# Altium project AVR_ISP_mkii.PrjPcb
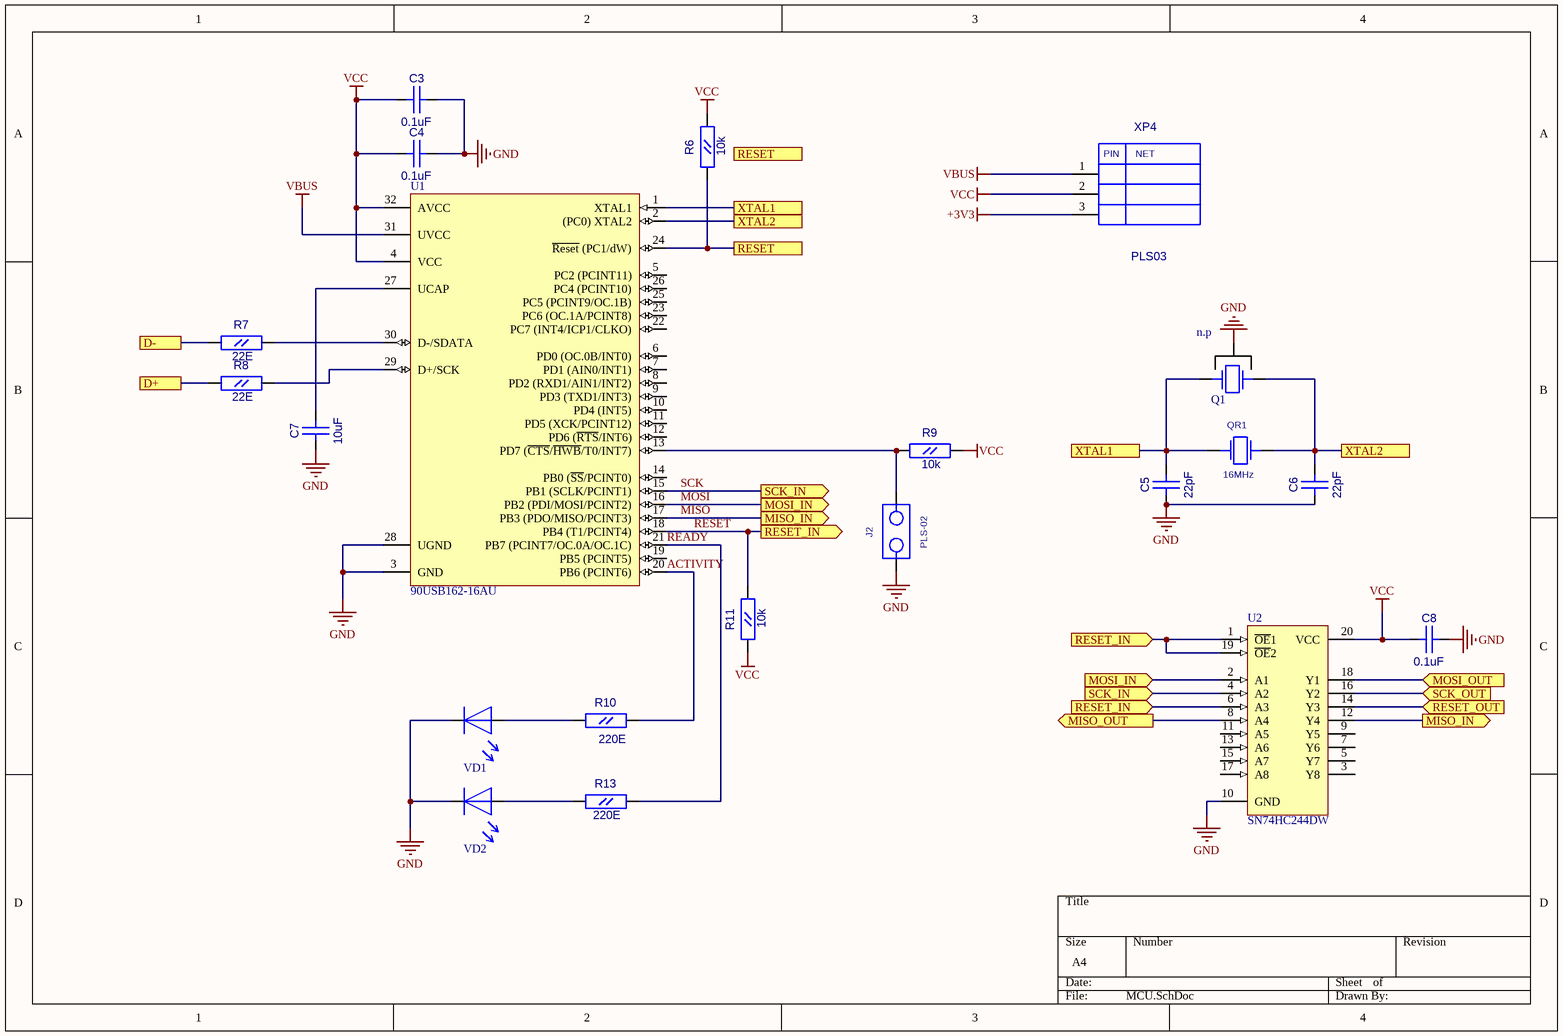
[diagram p0: MCU.SchDoc]
3 sheets, 38 parts. Net scope: flat (ports and power ports of the same name join across sheets).
Board file: AVR_ISP_mkii_clone.PcbDoc
Sheets:
  MCU.SchDoc
  Power.SchDoc
  Connections.SchDoc

## Sheet MCU.SchDoc
size A4

### Parts
C3  0.1uF  [CC0603]
C4  0.1uF  [CC0603]
C5  22pF  [CC0603]
C6  22pF  [CC0603]
C7  10uF  [CC0805]
C8  0.1uF  [CC0603]
J2  PLS-02  [PLS-02]
Q1  n.p  [AWSCR-16MHz]
QR1  16MHz  [AC5032_2]
R6  10k  [RC0603]
R7  22E  [RC0603]
R8  22E  [RC0603]
R9  10k  [RC0603]
R10  220E  [RC0603]
R11  10k  [RC0603]
R13  220E  [RC0603]
U1  90USB162-16AU  [32MA_N]
U2  SN74HC244DW  [DW020_N]
VD1  LED_0805  [LED0805]  (value not drawn)
VD2  LED_0805  [LED0805]  (value not drawn)
XP4  PLS03  [PLS-03]

### Ports
D+, D-, MISO_IN (out), MISO_OUT (out), MOSI_IN (in), MOSI_IN (out), MOSI_OUT (in), RESET, RESET_IN (in), RESET_IN (out), RESET_OUT (in), SCK_IN (in), SCK_IN (out), SCK_OUT (in), XTAL1, XTAL2

### Nets
+3V3: XP4.3
GND: C3.2(B) C4.2(B) C5.1(A) C6.1(A) C7.1(A) C8.2(B) J2.1 Q1.3 U1.3(GND) U1.28(UGND) U2.10(GND) VD1.2 VD2.2
VBUS: U1.31(UVCC) XP4.1
VCC: C3.1(A) C4.1(A) C8.1(A) R6.2(B) R9.2(B) R11.1(A) U1.4(VCC) U1.32(AVCC) U2.20(VCC) XP4.2
ACTIVITY: R10.2(B) U1.20(PB6_(PCINT6))
MISO: U1.17(PB3_(PDO/MISO/PCINT3)) U2.12(Y4) ; port MISO_IN
MOSI: U1.16(PB2_(PDI/MOSI/PCINT2)) U2.2(A1) ; port MOSI_IN
READY: R13.2(B) U1.21(PB7_(PCINT7/OC.0A/OC.1C))
RESET: R11.2(B) U1.18(PB4_(T1/PCINT4)) U2.1(~{OE}1) U2.6(A3) U2.19(~{OE}2) ; port RESET_IN
SCK: U1.15(PB1_(SCLK/PCINT1)) U2.4(A2) ; port SCK_IN
NetC5_2: C5.2(B) Q1.2 QR1.1 U1.1(XTAL1) ; port XTAL1
NetC6_2: C6.2(B) Q1.1 QR1.2 U1.2((PC0)_XTAL2) ; port XTAL2
NetC7_2: C7.2(B) U1.27(UCAP)
NetJ2_2: J2.2 R9.1(A) U1.13(PD7_(~{CTS}/~{HWB}/T0/INT7))
NetR1_1: U2.8(A4) ; port MISO_OUT
NetR2_2: U2.18(Y1) ; port MOSI_OUT
NetR3_1: U2.16(Y2) ; port SCK_OUT
NetR4_1: U2.14(Y3) ; port RESET_OUT
NetR6_1: R6.1(A) U1.24(~{Reset}_(PC1/dW)) ; port RESET
NetR7_1: R7.1(A) ; port D-
NetR7_2: R7.2(B) U1.30(D-/SDATA)
NetR8_1: R8.1(A) ; port D+
NetR8_2: R8.2(B) U1.29(D+/SCK)
NetR10_1: R10.1(A) VD1.1
NetR13_1: R13.1(A) VD2.1

Not connected (* = marked no-connect by the designer): U1 5(PC2_(PCINT11)) 6(PD0_(OC.0B/INT0)) 7(PD1_(AIN0/INT1)) 8(PD2_(RXD1/AIN1/INT2)) 9(PD3_(TXD1/INT3)) 10(PD4_(INT5)) 11(PD5_(XCK/PCINT12)) 12(PD6_(~{RTS}/INT6)) 14(PB0_(~{SS}/PCINT0)) 19(PB5_(PCINT5)) 22(PC7_(INT4/ICP1/CLKO)) 23(PC6_(OC.1A/PCINT8)) 25(PC5_(PCINT9/OC.1B)) 26(PC4_(PCINT10)); U2 3(Y8) 5(Y7) 7(Y6) 9(Y5) 11(A5) 13(A6) 15(A7) 17(A8)

### Notes on the sheet
- (in symbol PLS03) PIN; NET

### Library data of the parts
C3-C6 C8 = CC0603
  C3 C4 C8: Value: 0.1uF
  C5 C6: Value: 22pF
C7 = CC0805: Value: 10uF
Q1 = Q_AWSCR-16MHz: Value: AWSCR-16MHz; n.p: n.p
QR1 = AC5032_2: AC5032/2; Value: 16MHz
R6-R11 R13 = RC0603
  R6 R9 R11: Value: 10k
  R7 R8: Value: 22E
  R10 R13: Value: 220E
U1 = 90USB162-16AU: 8-bit AVR Microcontroller, 2.7-5.5V, 16KB Flash, 512 Bytes EEPROM, 512 Bytes SRAM, USB Controller, 32-pin TQFP, Industrial Grade (-40°C to 85°C); Published: 1-Apr-2010; DatasheetVersion: revE, Nov-2008; PackageVersion: revB, Jul-2007; PackageReference: 32MA; Publisher: Altium Limited; PackageDescription: 32-Lead Thin Profile Plastic Quad Flatpack (TQFP) - 7x7x1mm Body,  0.8 mm Pitch; ComponentLink1Description: Manufacturer Link; ComponentLink1URL: http://www.atmel.com/products/avr/default.asp?; ComponentLink2Description: AT90USB82/162 Datasheet; ComponentLink2URL: http://www.atmel.com/dyn/resources/prod_documents/doc7707.pdf; ComponentLink3Description: AT90USB82/162 Summary; ComponentLink3URL: http://www.atmel.com/dyn/resources/prod_documents/7707S.pdf; ComponentLink4Description: Atmel.com Home; ComponentLink4URL: http://www.atmel.com
U2 = SN74HC244DW: Octal Buffer and Line Driver with 3-State Outputs; Published: 8-Jun-2000; LatestRevisionDate: 13-Apr-2006; LatestRevisionNote: IPC-7351 Footprint Added.; DatasheetVersion: May-1997; PackageVersion: Mar-2000; PackageReference: DW020; Publisher: Altium Limited; PackageDescription: 20-Pin Plastic Small Outline Integrated Circuit 1.27 mm Pitch; Code_JEDEC: MS-013; Code_IPC: SOIC127P1030-20; ComponentLink1Description: Manufacturer Link; ComponentLink1URL: http://www.ti.com/; ComponentLink2Description: Datasheet; ComponentLink2URL: http://www-s.ti.com/sc/ds/sn74hc244.pdf
J2 = PLS-02: Value: *
VD1 VD2 = LED_0805: Value: LED_0805
XP4 = PLS03: Value: *

## Sheet Power.SchDoc
size A4
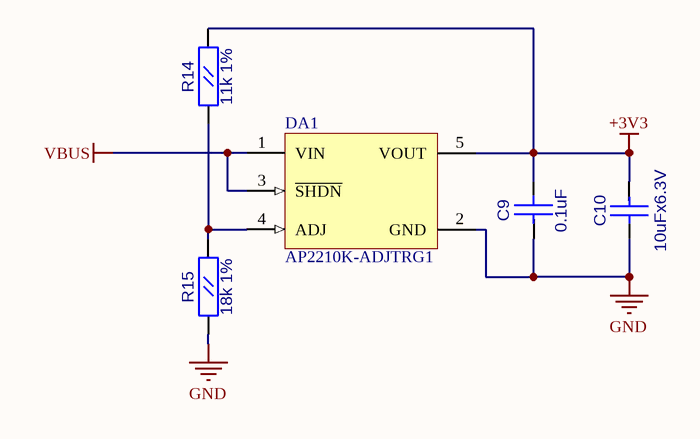
[diagram p1: Power.SchDoc]

### Parts
C9  0.1uF  [CC0603]
C10  10uFx6.3V  [CC0805]
DA1  AP2210K-ADJTRG1  [SOT23-5]
R14  11k 1%  [RC0603]
R15  18k 1%  [RC0603]

### Nets
+3V3: C9.1(A) C10.2(B) DA1.5(VOUT) R14.2(B)
GND: C9.2(B) C10.1(A) DA1.2(GND) R15.1(A)
VBUS: DA1.1(VIN) DA1.3(~{SHDN})
NetDA1_4: DA1.4(ADJ) R14.1(A) R15.2(B)

### Library data of the parts
C9 = CC0603: Value: 0.1uF
C10 = CC0805: Value: 10uFx6.3V
DA1 = MCP1824T-ADJE/OT: 300 mA, Low Voltage, Low Quiescent Current LDO Regulator, 5-Pin SOT-223, Extended Temperature, Tape and Reel; Published: 29-Jan-2009; DatasheetVersion: revA, Aug-2007; PackageVersion: revAW, Oct-2008; PackageReference: SOT-223-DC5; Publisher: Altium Limited; PackageDescription: 5-Lead Plastic Small Outline Transistor (DC) [SOT-223]; ComponentLink1Description: Manufacturer Link; ComponentLink1URL: http://www.microchip.com; ComponentLink2Description: Datasheet; ComponentLink2URL: http://ww1.microchip.com/downloads/en/DeviceDoc/22070a.pdf; ComponentLink3Description: Packaging Specification; ComponentLink3URL: http://ww1.microchip.com/downloads/en/PackagingSpec/00049AW.pdf
R14 R15 = RC0603
  R14: Value: 11k 1%
  R15: Value: 18k 1%

## Sheet Connections.SchDoc
size A4
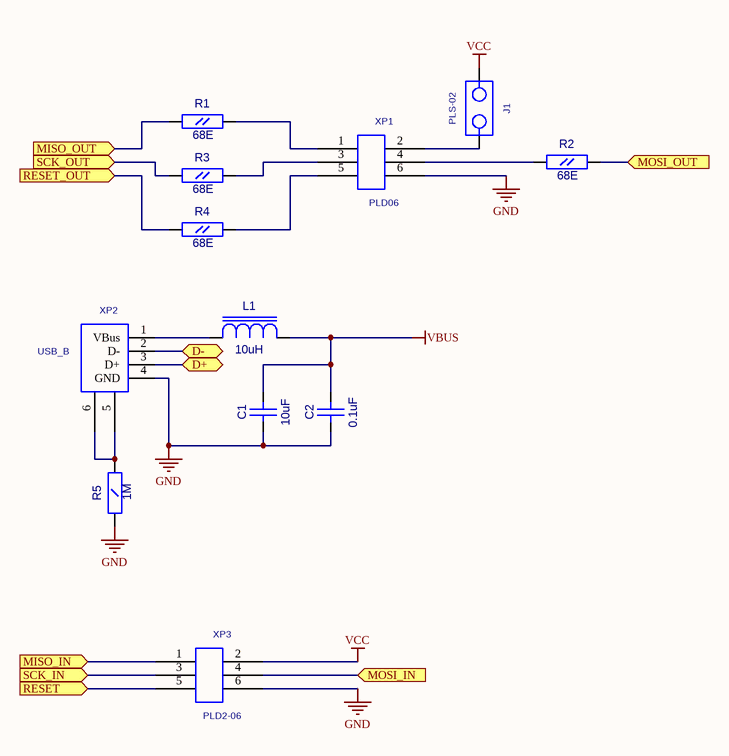
[diagram p2: Connections.SchDoc]

### Parts
C1  10uF  [CC0805]
C2  0.1uF  [CC0603]
J1  PLS-02  [PLS-02]
L1  value 10uH  [RC0805]  (hidden comment: L0805)
R1  68E  [RC0603]
R2  68E  [RC0603]
R3  68E  [RC0603]
R4  68E  [RC0603]
R5  1M  [RC1206]
XP1  PLD06  [PIN6]
XP2  USB_B  [USB-B]
XP3  PLD2-06  [PLD2-06]

### Ports
D+, D-, MISO_IN (in), MISO_OUT (in), MOSI_IN (in), MOSI_OUT (in), RESET (in), RESET_OUT (in), SCK_IN (in), SCK_OUT (in)

### Nets
GND: C1.1(A) C2.1(A) R5.1(A) XP1.6 XP2.4(GND) XP3.6
VBUS: C1.2(B) C2.2(B) L1.2(B)
VCC: J1.1 XP3.2
MISO: XP3.1 ; port MISO_IN
MOSI: XP3.4 ; port MOSI_IN
SCK: XP3.3 ; port SCK_IN
NetJ1_2: J1.2 XP1.2
NetL1_1: L1.1(A) XP2.1(VBus)
NetR1_1: R1.1(A) ; port MISO_OUT
NetR1_2: R1.2(B) XP1.1
NetR2_1: R2.1(A) XP1.4
NetR2_2: R2.2(B) ; port MOSI_OUT
NetR3_1: R3.1(A) ; port SCK_OUT
NetR3_2: R3.2(B) XP1.3
NetR4_1: R4.1(A) ; port RESET_OUT
NetR4_2: R4.2(B) XP1.5
NetR5_2: R5.2(B) XP2.5 XP2.6
NetR6_1: XP3.5 ; port RESET
NetR7_1: XP2.2(D-) ; port D-
NetR8_1: XP2.3(D+) ; port D+

### Library data of the parts
C1 = CC0805: Value: 10uF
C2 = CC0603: Value: 0.1uF
R1-R4 = RC0603: Value: 68E
R5 = RC1206: Value: 1M
J1 = PLS-02: Value: *
XP1 = PLD06: Value: *
XP2 = USB_B: Value: *
XP3 = PLD2-06: Value: *

## Nets that join several sheets
+3V3: MCU (XP4.3), Power (C9.1 C10.2 DA1.5 R14.2)
GND: MCU (13 pins), Power (C9.2 C10.1 DA1.2 R15.1), Connections (6 pins)
VBUS: MCU (U1.31 XP4.1), Power (DA1.1 DA1.3), Connections (C1.2 C2.2 L1.2)
VCC: MCU (10 pins), Connections (J1.1 XP3.2)
MISO: MCU (U1.17 U2.12), Connections (XP3.1)
MOSI: MCU (U1.16 U2.2), Connections (XP3.4)
NetR1_1: MCU (U2.8), Connections (R1.1)
NetR2_2: MCU (U2.18), Connections (R2.2)
NetR3_1: MCU (U2.16), Connections (R3.1)
NetR4_1: MCU (U2.14), Connections (R4.1)
NetR6_1: MCU (R6.1 U1.24), Connections (XP3.5)
NetR7_1: MCU (R7.1), Connections (XP2.2)
NetR8_1: MCU (R8.1), Connections (XP2.3)
SCK: MCU (U1.15 U2.4), Connections (XP3.3)